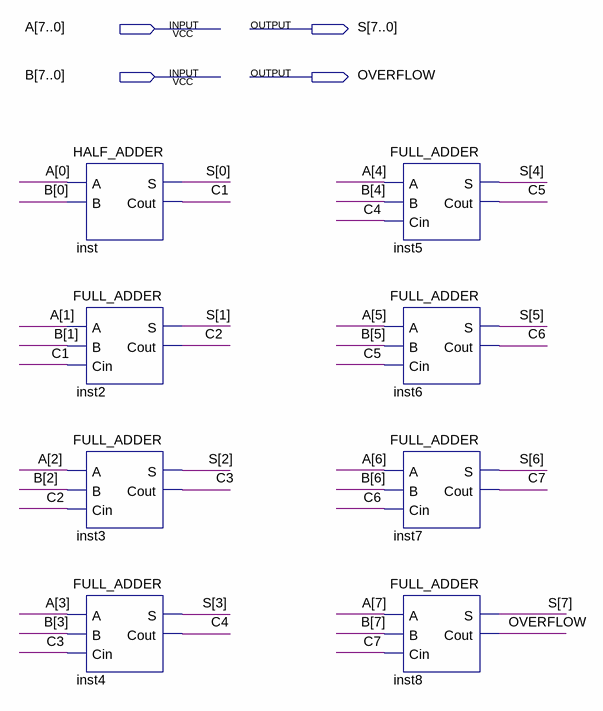
[diagram p0: schematic sheet]
// Quartus schematic RCA_8_BITS.bdf as structural Verilog: 8 symbols, 4 pins
module RCA_8_BITS (
  input  [7:0] A,
  input  [7:0] B,
  output [7:0] S,
  output OVERFLOW
);

  wire C1, C2, C3, C4, C5, C6, C7;

  HALF_ADDER inst (.A(A[0]), .B(B[0]), .S(S[0]), .Cout(C1));
  FULL_ADDER inst2 (.A(A[1]), .B(B[1]), .Cin(C1), .S(S[1]), .Cout(C2));
  FULL_ADDER inst3 (.A(A[2]), .B(B[2]), .Cin(C2), .S(S[2]), .Cout(C3));
  FULL_ADDER inst4 (.A(A[3]), .B(B[3]), .Cin(C3), .S(S[3]), .Cout(C4));
  FULL_ADDER inst5 (.A(A[4]), .B(B[4]), .Cin(C4), .S(S[4]), .Cout(C5));
  FULL_ADDER inst6 (.A(A[5]), .B(B[5]), .Cin(C5), .S(S[5]), .Cout(C6));
  FULL_ADDER inst7 (.A(A[6]), .B(B[6]), .Cin(C6), .S(S[6]), .Cout(C7));
  FULL_ADDER inst8 (.A(A[7]), .B(B[7]), .Cin(C7), .S(S[7]), .Cout(OVERFLOW));
endmodule
